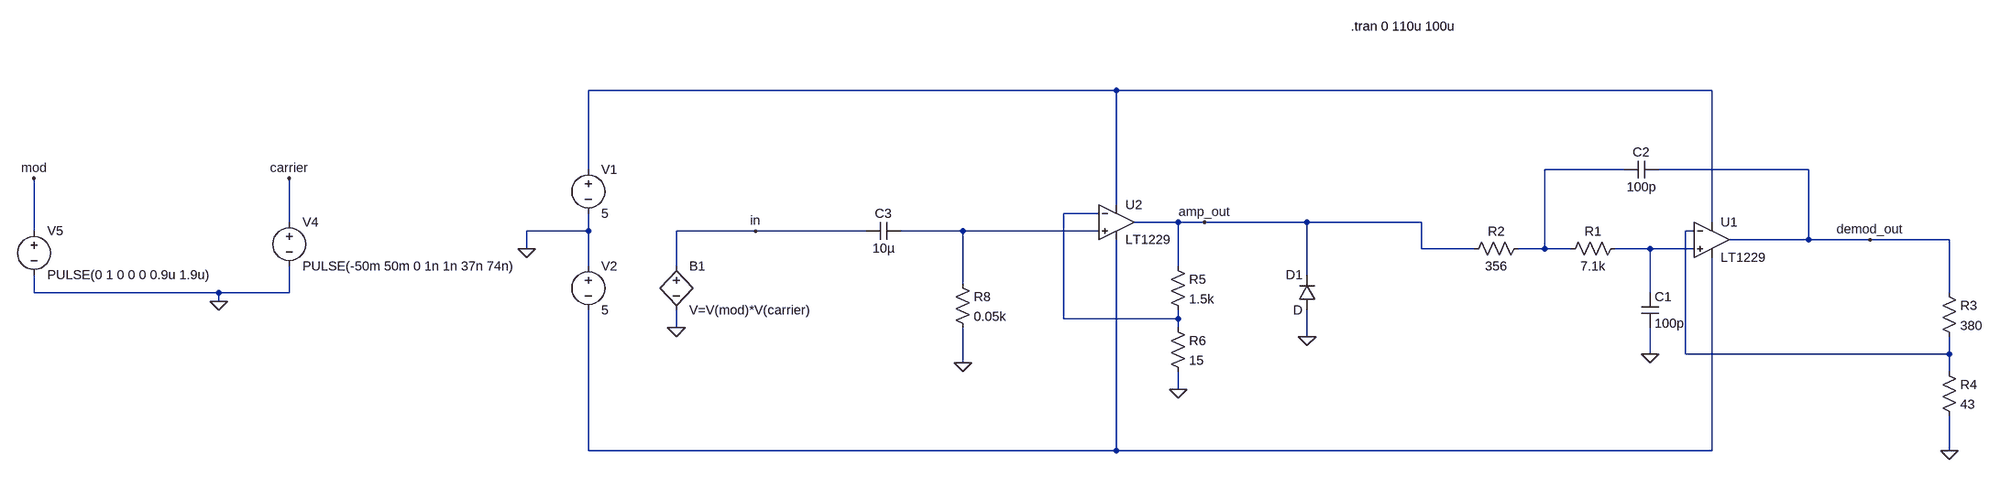
[diagram p0: schematic lt1229_amp_filter.asc]
lt1229_amp_filter.asc, the LTspice schematic file:
Version 4
SHEET 1 880 680
WIRE -1136 -112 -2560 -112
WIRE 160 -112 -1136 -112
WIRE -2560 32 -2560 -112
WIRE 0 32 -144 32
WIRE 336 32 64 32
WIRE -1136 96 -1136 -112
WIRE -1168 112 -1232 112
WIRE -3104 128 -3104 48
WIRE -1024 128 -1104 128
WIRE -976 128 -1024 128
WIRE -576 128 -976 128
WIRE -368 128 -576 128
WIRE 160 128 160 -112
WIRE -3568 144 -3568 48
WIRE -2560 144 -2560 112
WIRE -2560 144 -2672 144
WIRE -2256 144 -2400 144
WIRE -1920 144 -2256 144
WIRE -1744 144 -1856 144
WIRE -1168 144 -1744 144
WIRE 128 144 112 144
WIRE 336 160 336 32
WIRE 336 160 192 160
WIRE 448 160 336 160
WIRE 592 160 448 160
WIRE -2672 176 -2672 144
WIRE -368 176 -368 128
WIRE -272 176 -368 176
WIRE -144 176 -144 32
WIRE -144 176 -192 176
WIRE -96 176 -144 176
WIRE 48 176 -16 176
WIRE 128 176 48 176
WIRE -2560 208 -2560 144
WIRE -2400 208 -2400 144
WIRE -1024 208 -1024 128
WIRE -576 224 -576 128
WIRE -1744 240 -1744 144
WIRE -3568 256 -3568 224
WIRE -3232 256 -3568 256
WIRE -3104 256 -3104 208
WIRE -3104 256 -3232 256
WIRE 48 256 48 176
WIRE 592 256 592 160
WIRE -3232 272 -3232 256
WIRE -1232 304 -1232 112
WIRE -1024 304 -1024 288
WIRE -1024 304 -1232 304
WIRE -2400 320 -2400 288
WIRE -1024 320 -1024 304
WIRE -576 336 -576 288
WIRE 48 368 48 320
WIRE 112 368 112 144
WIRE 592 368 592 336
WIRE 592 368 112 368
WIRE -1744 384 -1744 320
WIRE 592 400 592 368
WIRE -1024 432 -1024 400
WIRE -2560 544 -2560 288
WIRE -1136 544 -1136 160
WIRE -1136 544 -2560 544
WIRE 160 544 160 192
WIRE 160 544 -1136 544
WIRE 592 544 592 480
FLAG -2672 176 0
FLAG -2400 320 0
FLAG 592 544 0
FLAG 448 160 demod_out
FLAG 48 368 0
FLAG -3232 272 0
FLAG -3568 48 mod
FLAG -3104 48 carrier
FLAG -2256 144 in
FLAG -1024 432 0
FLAG -1744 384 0
FLAG -976 128 amp_out
FLAG -576 336 0
SYMBOL Opamps\\LT1229 160 96 R0
SYMATTR InstName U1
SYMBOL voltage -2560 16 R0
WINDOW 123 0 0 Left 2
WINDOW 39 0 0 Left 2
SYMATTR InstName V1
SYMATTR Value 5
SYMBOL voltage -2560 192 R0
WINDOW 123 0 0 Left 2
WINDOW 39 0 0 Left 2
SYMATTR InstName V2
SYMATTR Value 5
SYMBOL res 0 160 R90
WINDOW 0 0 56 VBottom 2
WINDOW 3 32 56 VTop 2
SYMATTR InstName R1
SYMATTR Value 7.1k
SYMBOL res -176 160 R90
WINDOW 0 0 56 VBottom 2
WINDOW 3 32 56 VTop 2
SYMATTR InstName R2
SYMATTR Value 356
SYMBOL cap 32 256 R0
SYMATTR InstName C1
SYMATTR Value 100p
SYMBOL cap 64 16 R90
WINDOW 0 0 32 VBottom 2
WINDOW 3 32 32 VTop 2
SYMATTR InstName C2
SYMATTR Value 100p
SYMBOL res 576 240 R0
SYMATTR InstName R3
SYMATTR Value 380
SYMBOL res 576 384 R0
SYMATTR InstName R4
SYMATTR Value 43
SYMBOL voltage -3104 112 R0
WINDOW 123 0 0 Left 2
WINDOW 39 0 0 Left 2
SYMATTR InstName V4
SYMATTR Value PULSE(-50m 50m 0 1n 1n 37n 74n)
SYMBOL voltage -3568 128 R0
WINDOW 123 0 0 Left 2
WINDOW 39 0 0 Left 2
SYMATTR InstName V5
SYMATTR Value PULSE(0 1 0 0 0 0.9u 1.9u)
SYMBOL bv -2400 192 R0
SYMATTR InstName B1
SYMATTR Value V=V(mod)*V(carrier)
SYMBOL Opamps\\LT1229 -1136 64 R0
SYMATTR InstName U2
SYMBOL res -1760 224 R0
SYMATTR InstName R8
SYMATTR Value 0.05k
SYMBOL cap -1856 128 R90
WINDOW 0 0 32 VBottom 2
WINDOW 3 32 32 VTop 2
SYMATTR InstName C3
SYMATTR Value 10µ
SYMBOL res -1040 192 R0
SYMATTR InstName R5
SYMATTR Value 1.5k
SYMBOL res -1040 304 R0
SYMATTR InstName R6
SYMATTR Value 15
SYMBOL diode -560 288 R180
WINDOW 0 24 64 Left 2
WINDOW 3 24 0 Left 2
SYMATTR InstName D1
TEXT -496 -264 Left 2 !.tran 0 110u 100u

The netlist it stands for:
* lt1229_amp_filter.asc
XU1 N006 N005 N001 N007 demod_out LT1229  ; pins In+ In- V+ V- OUT
V1 N001 0 5
V2 0 N007 5
R1 N006 N002 7.1k
R2 N002 amp_out 356
C1 N006 0 100p
C2 demod_out N002 100p
R3 demod_out N005 380
R4 N005 0 43
V4 carrier 0 PULSE(-50m 50m 0 1n 1n 37n 74n)
V5 mod 0 PULSE(0 1 0 0 0 0.9u 1.9u)
B1 in 0 V=V(mod)*V(carrier)
XU2 N004 N003 N001 N007 amp_out LT1229  ; pins In+ In- V+ V- OUT
R8 N004 0 0.05k
C3 N004 in 10µ
R5 amp_out N003 1.5k
R6 N003 0 15
D1 0 amp_out D
.model D D
.lib standard.dio
.tran 0 110u 100u
.backanno
.end